# EAGLE design remote (EAGLE 9.6.2)
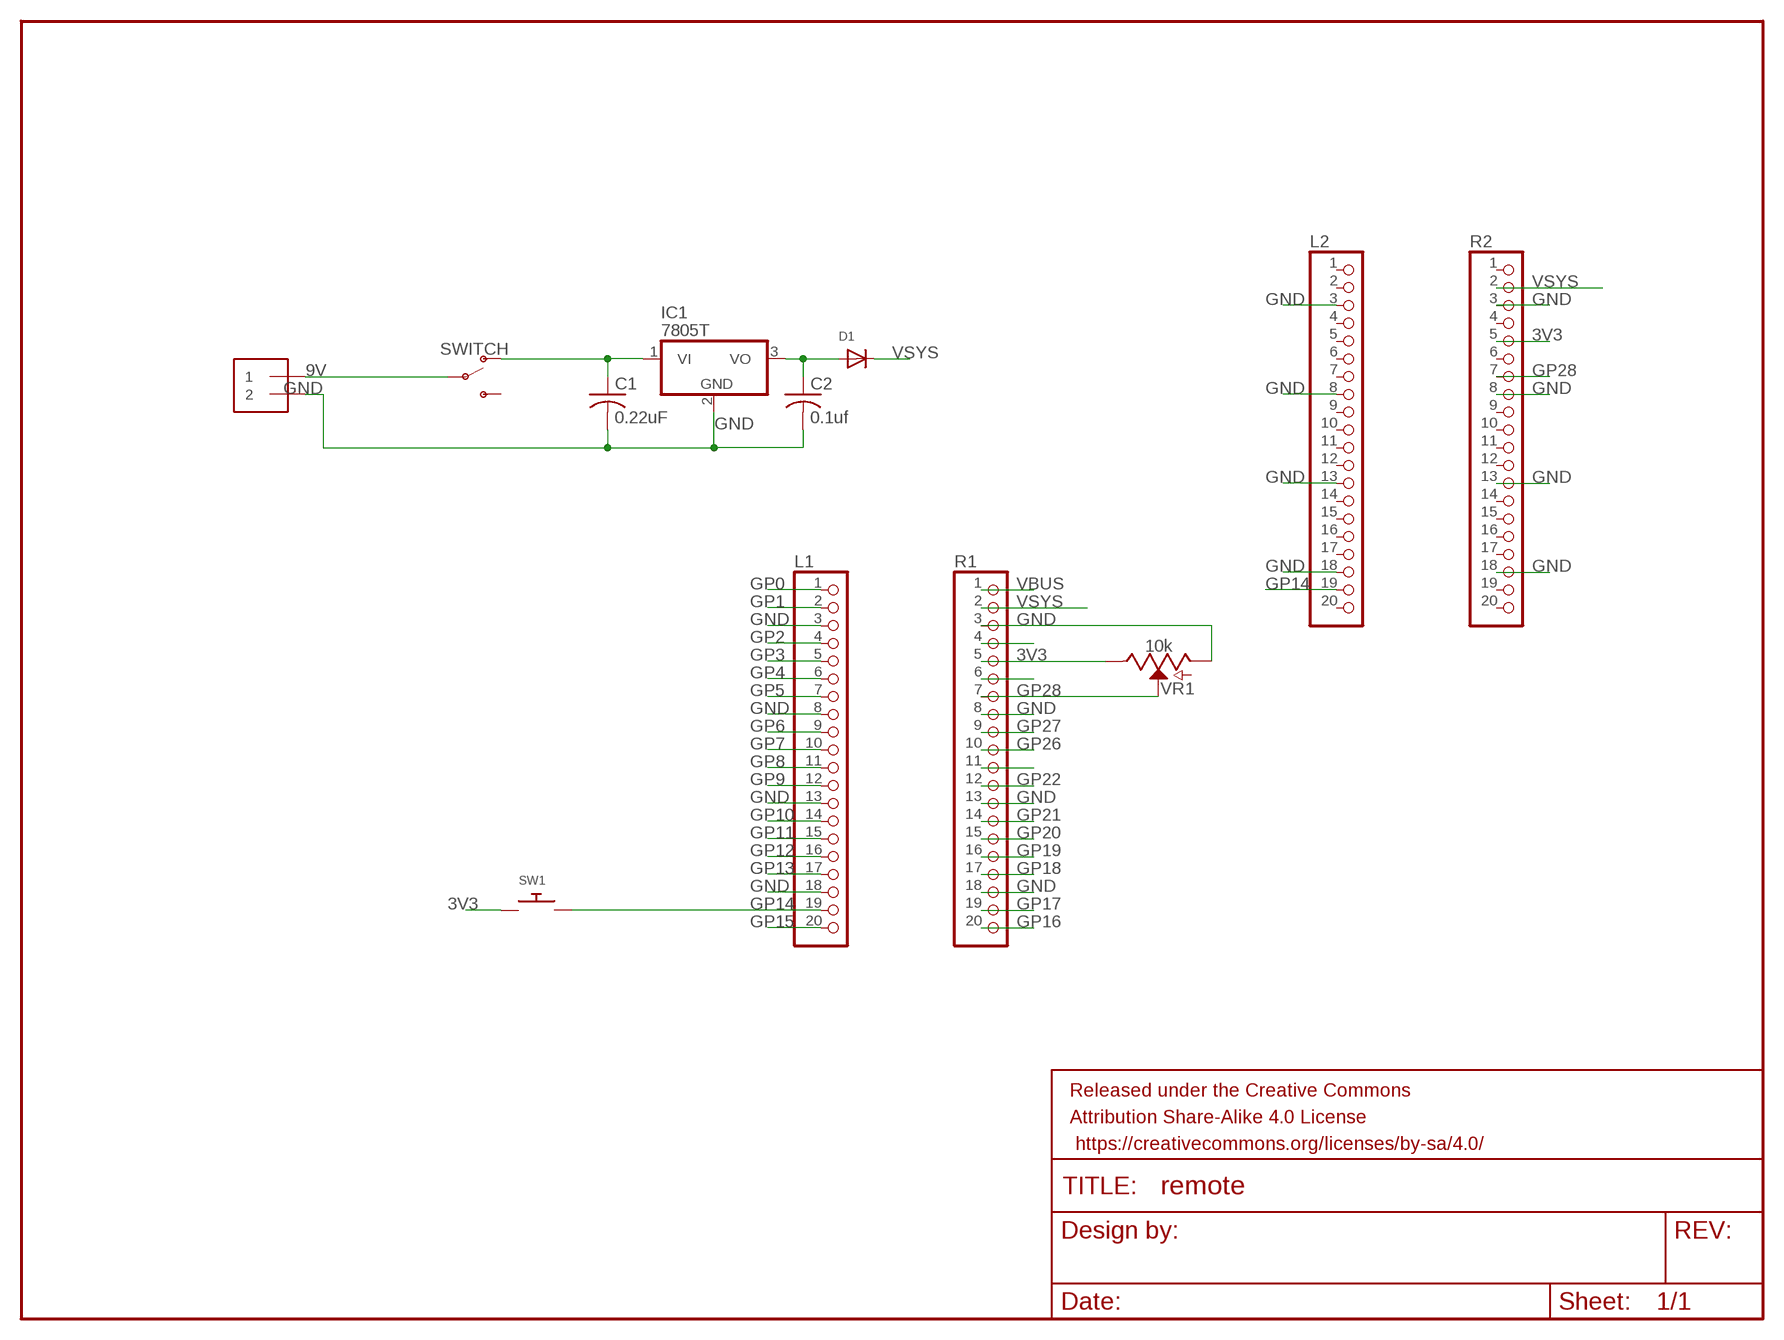
[diagram p0: schematic, sheet 1]

## Parts
9VBAT  1X2-3.5MM  [1X2-3.5MM]
C1  0.22uF  C-US050-025X075  [C050-025X075]
C2  0.1uf  C-US050-025X075  [C050-025X075]
D1  DIODEDO-1N4148  [DO-1N4148]
FRAME1  FRAME-LETTER  [CREATIVE_COMMONS]
IC1  7805T  [TO220H]
L1  PINHD-1X20  [1X20]
L2  PINHD-1X20  [1X20]
R1  PINHD-1X20  [1X20]
R2  PINHD-1X20  [1X20]
SW1  SWITCH_PUSHBUTTONEVQ-PE  [TACT_PANA-EVQ]
SWITCH  SWITCH-SPDT-PTH-11.6X4.0MM-LOCK  [SWITCH_SPDT_PTH_11.6X4.0MM_LOCK]
VR1  10k  POTENTIOMETER-PTH-9MM-1/20W-20%  [POT-PTH-ALPS]

## Nets
3V3: R1.5 R2.5 SW1.P$1 VR1.P$1(E)
9V: 9VBAT.1 SWITCH.2(P)
GND: 9VBAT.2 C1.2 C2.2 IC1.2(GND) L1.3 L1.8 L1.13 L1.18 L2.3 L2.8 L2.13 L2.18 R1.3 R1.8 R1.13 R1.18 R2.3 R2.8 R2.13 R2.18 VR1.P$3(A)
GP0: L1.1
GP1: L1.2
GP2: L1.4
GP3: L1.5
GP4: L1.6
GP5: L1.7
GP6: L1.9
GP7: L1.10
GP8: L1.11
GP9: L1.12
GP10: L1.14
GP11: L1.15
GP12: L1.16
GP13: L1.17
GP14: L1.19 L2.19 SW1.P$2
GP15: L1.20
GP16: R1.20
GP17: R1.19
GP18: R1.17
GP19: R1.16
GP20: R1.15
GP21: R1.14
GP22: R1.12
GP26: R1.10
GP27: R1.9
GP28: R1.7 R2.7 VR1.P$2(S)
N$2: C2.1 D1.A IC1.3(VO)
N$3: C1.1 IC1.1(VI) SWITCH.1(O)
N$24: R1.4
N$26: R1.6
N$31: R1.11
VBUS: R1.1
VSYS: D1.C R1.2 R2.2
Unconnected: L2.1 L2.2 L2.4 L2.5 L2.6 L2.7 L2.9 L2.10 L2.11 L2.12 L2.14 L2.15 L2.16 L2.17 L2.20 R2.1 R2.4 R2.6 R2.9 R2.10 R2.11 R2.12 R2.14 R2.15 R2.16 R2.17 R2.19 R2.20 SWITCH.3(S)

## Library data of the parts
9VBAT = adafruit:1X2: 3.5mm Terminal block http://www.ladyada.net/library/pcb/eaglelibrary.html
C1 C2 = adafruit:C-US: CAPACITOR, American symbol
D1 = adafruit:DIODE: Diode SMADIODE - SMA Surface Mount Package 20V 1A Schottky Diode Digikey: 641-1014-6-ND DO-1N4148 - Through Hole Small Current Diode SOD-123 20V 1 A (.5mV Vf) Schottky Diode - Digikey: MBRX120TPMSCT-ND SOD-323 10V 570mA (.38mV Vf, 3ns) Schottky Diode - Digikey: ZLLS410CT-ND SOD-523 30V 30mA Schottky Diode (RB751S-40TE61) - Digikey: RB751S-40TE61CT-ND SOT23-R/W - SOT23 Package (R = Solder Paste/Reflow Ovens, W = Hand-Soldering) BAT54Film 40V 300mA - Digikey: 497-7162-1-ND
FRAME1 = SparkFun-Aesthetics:FRAME-LETTER: Schematic Frame - Letter Standard 8.5x11 US Letter frame
IC1 = adafruit:78*: Positive VOLTAGE REGULATOR Added bigger pads to the TO-92 package
L1 L2 R1 R2 = pinhead:PINHD-1X20: PIN HEADER
SW1 = adafruit:SWITCH_PUSHBUTTON: Buttons SOFTTOUCHSMD_SJ - Soft touch temporary push button (Super Junk Akihabara) Compatible with SKPMANE010 [Mouser: 688-SKPMAN] C&K_KSS = Digikey: KSS221GLFS
SWITCH = SparkFun-Switches:SWITCH-SPDT: Single Pole, Double Throw (SPDT) Switch Single-pole, double-throw (SPDT) switch. Variant Overview SMD-AYZ0202 Surface Mount DPDT Switch <https://www.sparkfun.com/products/597> (COM-00597) Used on e.g. LilyPad Arduino USB - ATmega32U4 Board <https://www.sparkfun.com/products/12049> PTH-11.6X4.0MM SPDT Mini Power Switch <https://www.sparkfun.com/products/102> (COM-00102) Used on e.g. SparkFun Simon Says - Through-Hole Soldering Kit <https://www.sparkfun.com/products/10547> (KIT-10547) PTH-11.6X4.0MM-KIT KIT version of SPDT Mini Power Switch - Simplifies soldering by removing tStop of switch pins - only one side can be soldered. PTH-11.6X4.0MM-LOCK LOCK version of SPDT Mini Power Switch - Offset pins hold switch in place for easier soldering. SMD-RIGHT-ANGLE Surface Mount Right Angle Switch <https://www.sparkfun.com/products/10860> (COM-10860) Used on e.g. SparkFun ESP8266 Thing <https://www.sparkfun.com/products/13231>; PROD_ID: SWCH-08261; SF_SKU: COM-00102
VR1 = SparkFun-Resistors:POTENTIOMETER: Potentiometer (Pot) Three-terminal potentiometers, with an adjustable wiper and two adjustable resistors. A pot can be used to create a configurable voltage divider, or as a variable resistor. Variants ALPS_POT and ALPS_POT_KIT - PTH, breadboard compatible, 9mm square pots Rotary Potentiometer - Linear (10k ohm) <https://www.sparkfun.com/products/9288> (COM-09288) The KIT variant exposes copper on only one side of the PTH pad, so the part can only be assembled on one side of the PCB. Useful for beginner soldering kits.; PROD_ID: RES-09177; SF_SKU: COM-09288

## Board
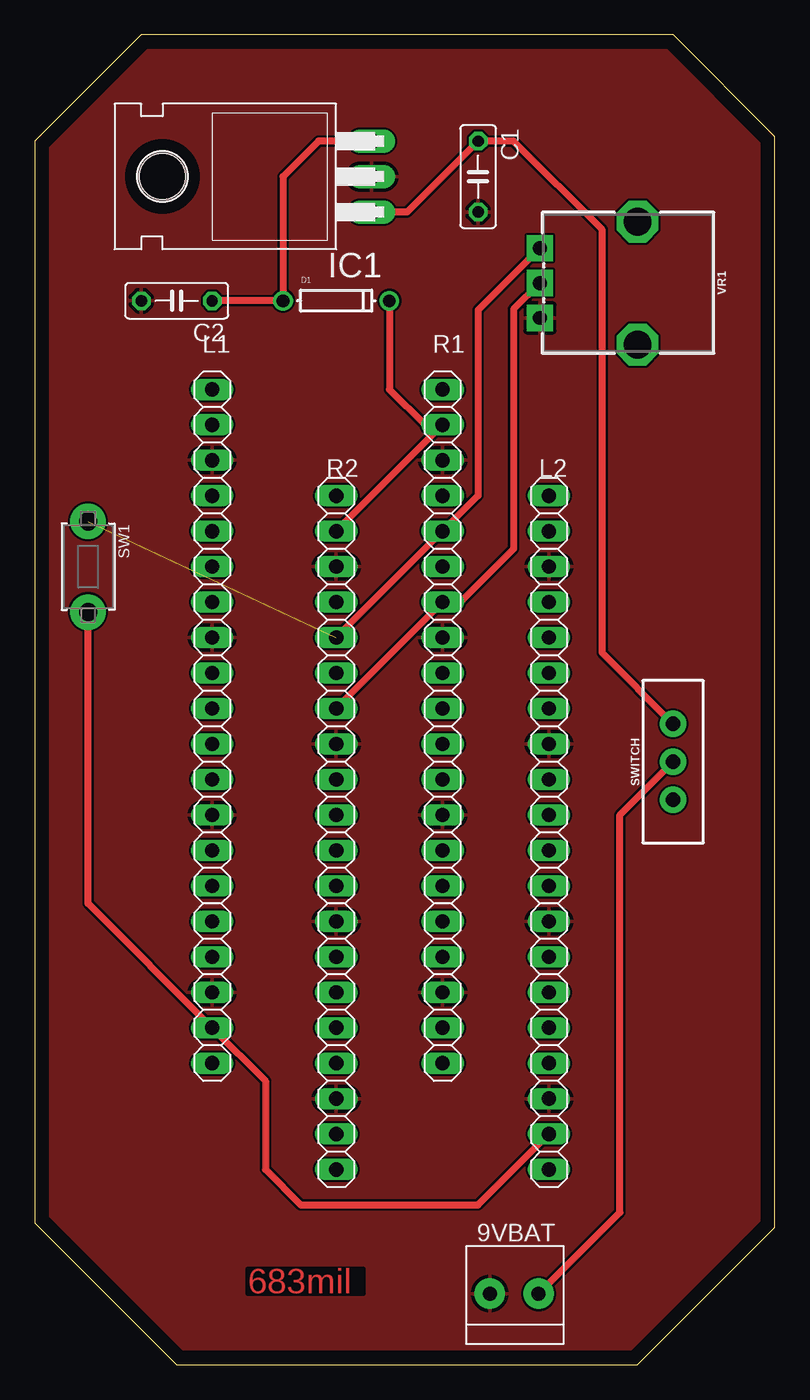
[diagram p1: board, top side]

Size 53.01 x 95.24 mm. Coordinates in mm from the lower left corner, seen from the top.
Outline: 0,87.63 0,10.16 10.16,0 43.18,0 53.01,9.83 53.01,87.96 45.73,95.24 7.61,95.24 0,87.63
Copper layers (1*16): Top 0.035mm / dielectric 1.5mm / Bottom 0.035mm
Design rules "default": minimum track width 6mil, minimum drill 0.35mm, track to track 6mil, track to pad 6mil, pad to pad 6mil, via to via 6mil, smd to smd 6mil, copper to edge 40mil, drill to drill 6mil, minimum pad ring 10mil, minimum via ring 8mil, stop-mask expansion 4mil, vias tented up to drill 0mil, thermal gap 10mil

### Footprints (pad centres in the part's own frame; a part is rotated, then mirrored left to right if it is on the bottom)
1X2-3.5MM = drill 1 pad 2.184: 1 1.8,0; 2 -1.7,0
C050-025X075 = drill 0.813 octagon: 1 -2.54,0; 2 2.54,0
DO-1N4148 = drill 0.9: A -3.81,0; C 3.81,0
TO220H = drill 1.118 long: 1 -2.54,-10.16; 2 0,-10.16; 3 2.54,-10.16 | hole 3.302: 0,4.826
1X20 = drill 1.016 long: 1 -24.13,0; 2 -21.59,0; 3 -19.05,0; 4 -16.51,0; 5 -13.97,0; 6 -11.43,0; 7 -8.89,0; 8 -6.35,0; 9 -3.81,0; 10 -1.27,0; 11 1.27,0; 12 3.81,0; 13 6.35,0; 14 8.89,0; 15 11.43,0; 16 13.97,0; 17 16.51,0; 18 19.05,0; 19 21.59,0; 20 24.13,0
TACT_PANA-EVQ = drill 1.3 pad 2.54: P$1 -3.25,0; P$2 3.25,0
SWITCH_SPDT_PTH_11.6X4.0MM_LOCK = drill 1.016 pad 1.88: 1 0,2.718; 2 0,0; 3 0,-2.718
POT-PTH-ALPS = drill 1 pad 1.88 square: P$1 7,-2.5; P$2 7,0; P$3 7,2.5 | drill 2 octagon: P$4 0,-4.4; P$5 0,4.4

### Placement (x,y rotation side)
9VBAT  34.29,5.08 0 top
C1  31.75,85.09 270 top
C2  10.16,76.2 180 top
D1  21.59,76.2 0 top
FRAME1  2.54,113.03 0 top  (outside the outline)
IC1  13.97,85.09 90 top
L1  12.7,45.72 270 top
L2  36.83,38.1 270 top
R1  29.21,45.72 270 top
R2  21.59,38.1 270 top
SW1  3.81,57.15 270 top
SWITCH  45.72,43.18 0 top
VR1  43.18,77.47 180 top

### Tracks (layer width: path | path; a pad name or v marks a point on that pad's centre or on a via)
3V3  (1 unrouted)
  Top 0.508: VR1.P$1 31.75,75.54 31.75,62.23 R1.5 R2.5
9V
  Top 0.508: 9VBAT.1 41.91,10.9 41.91,39.37 SWITCH.2
GND
  pour Top: -6.35,106.68 -6.35,-8.89 64.77,-8.89 64.77,106.68
GP14
  Top 0.508: L2.19 31.75,11.43 19.05,11.43 16.51,13.97 16.51,20.32 L1.19 3.81,33.02 SW1.P$2
GP28
  Top 0.508: VR1.P$2 34.29,75.58 34.29,58.42 30.48,54.61 R1.7 R2.7
N$2
  Top 0.508: C2.1 D1.A 17.78,85.09 20.32,87.63 IC1.3
N$3
  Top 0.508: SWITCH.1 40.64,50.98 40.64,81.28 34.29,87.63 C1.1 26.67,82.55 IC1.1
VSYS
  Top 0.508: D1.C 25.4,69.85 27.94,67.31 R1.2 R2.2

### Text on the board
Top: 683mil